# EAGLE schematic +5V_-5V_3.3V_PowerSupply (EAGLE 7.2.0)
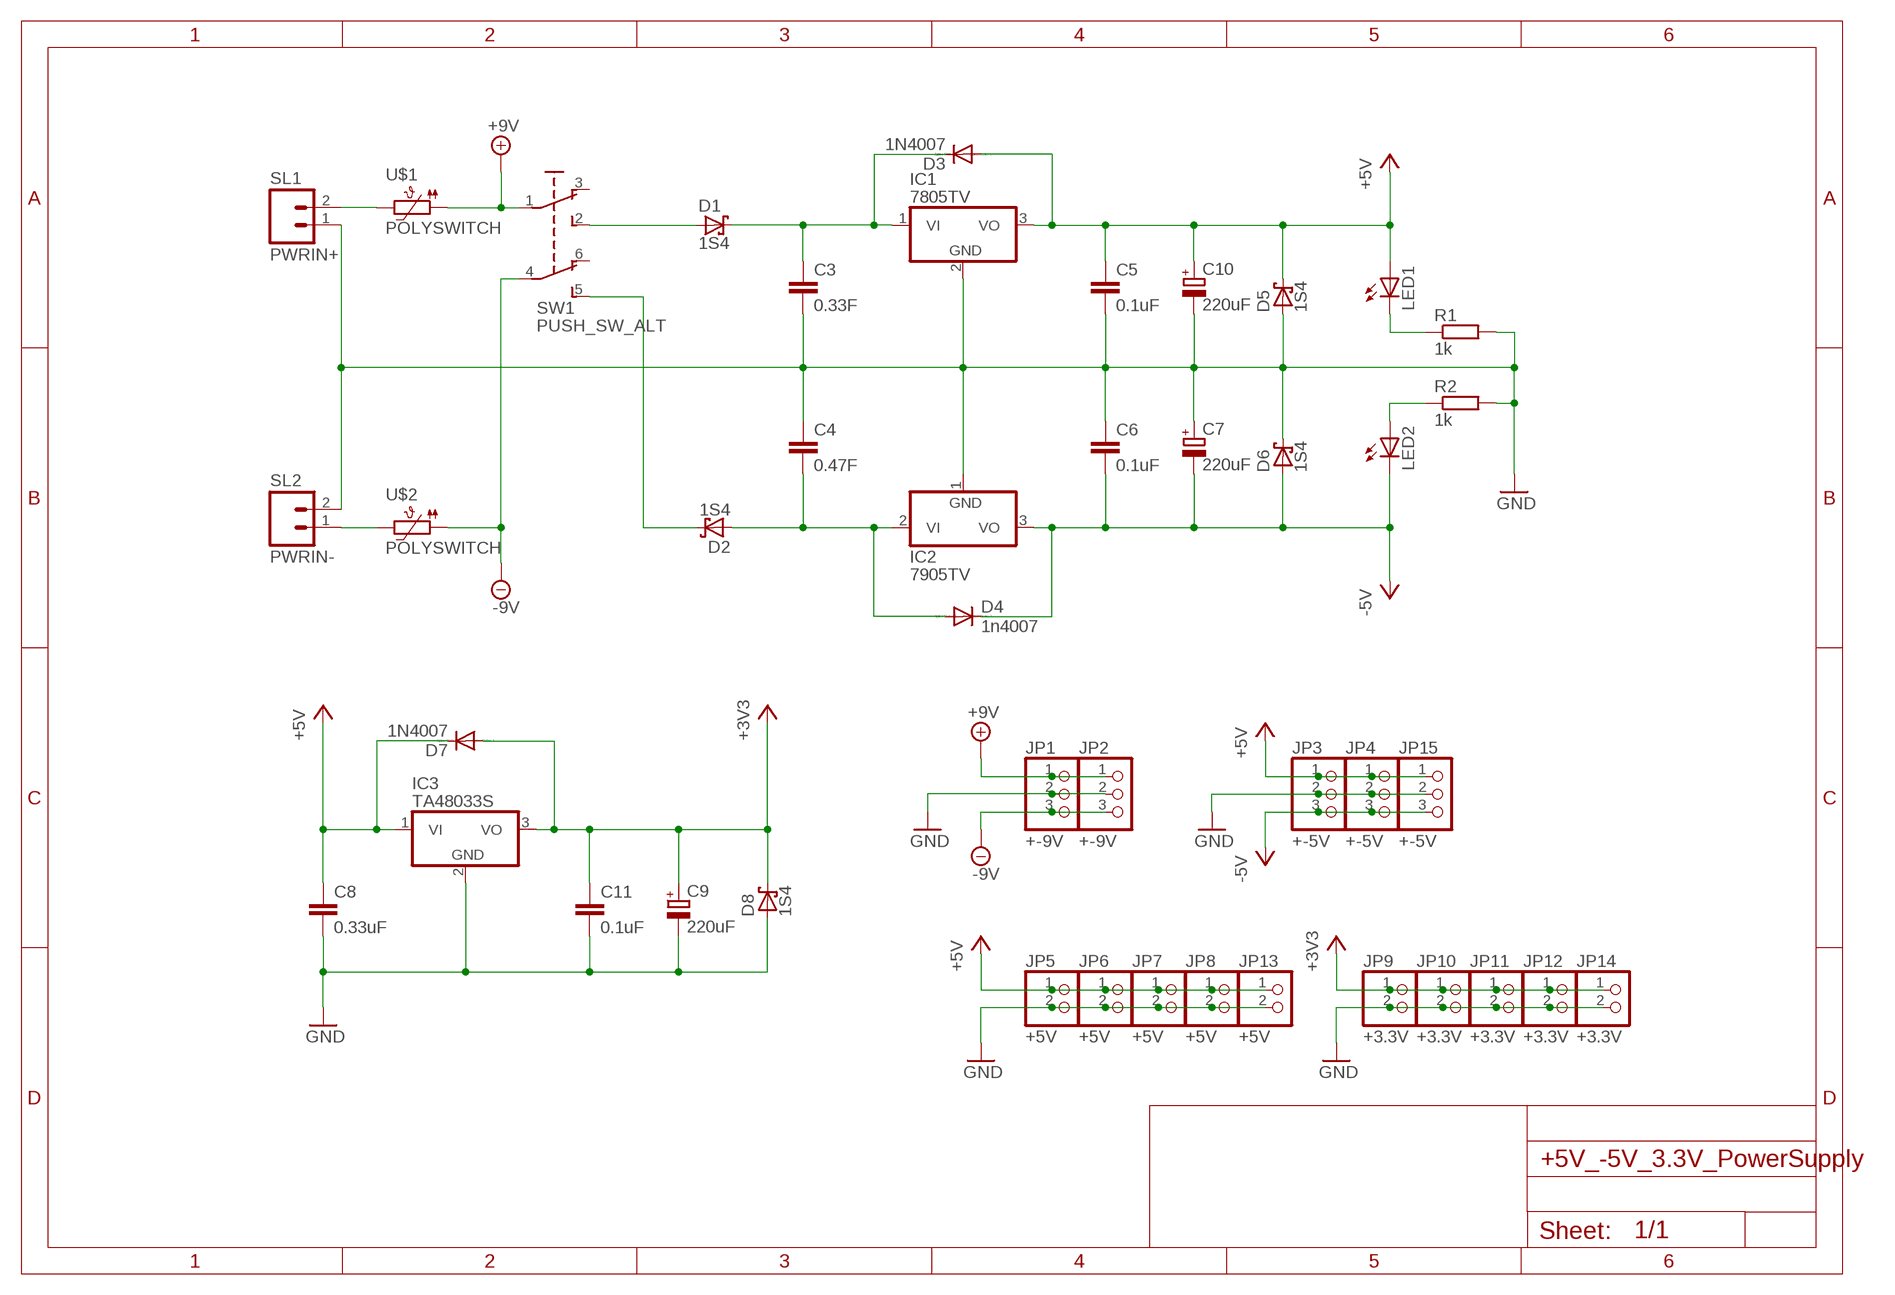
[diagram p0: schematic, sheet 1]

## Parts
C3  0.33F  C-EU050-025X075  [C050-025X075]
C4  0.47F  C-EU050-025X075  [C050-025X075]
C5  0.1uF  C-EU050-024X044  [C050-024X044]
C6  0.1uF  C-EU050-024X044  [C050-024X044]
C7  220uF  CPOL-EUE2.5-6  [E2,5-6]
C8  0.33uF  C-EU050-025X075  [C050-025X075]
C9  220uF  CPOL-EUE2.5-6  [E2,5-6]
C10  220uF  CPOL-EUE2.5-6  [E2,5-6]
C11  0.1uF  C-EU050-025X075  [C050-025X075]
D1  1S4  SCHOTTKY-DIODEDO35-7  [DO35-7]
D2  1S4  SCHOTTKY-DIODEDO35-7  [DO35-7]
D3  1N4007  DIODE-D-7.5  [D-7.5]
D4  1n4007  DIODE-D-7.5  [D-7.5]
D5  1S4  SCHOTTKY-DIODEDO35-7  [DO35-7]
D6  1S4  SCHOTTKY-DIODEDO35-7  [DO35-7]
D7  1N4007  DIODE-D-7.5  [D-7.5]
D8  1S4  SCHOTTKY-DIODEDO35-7  [DO35-7]
IC1  7805TV  [TO220V]
IC2  7905TV  [TO220V]
IC3  TA48033S  7805TV  [TO220V]
JP1  +-9V  PINHD-1X3  [1X03]
JP2  +-9V  PINHD-1X3  [1X03]
JP3  +-5V  PINHD-1X3  [1X03]
JP4  +-5V  PINHD-1X3  [1X03]
JP5  +5V  PINHD-1X2  [1X02]
JP6  +5V  PINHD-1X2  [1X02]
JP7  +5V  PINHD-1X2  [1X02]
JP8  +5V  PINHD-1X2  [1X02]
JP9  +3.3V  PINHD-1X2  [1X02]
JP10  +3.3V  PINHD-1X2  [1X02]
JP11  +3.3V  PINHD-1X2  [1X02]
JP12  +3.3V  PINHD-1X2  [1X02]
JP13  +5V  PINHD-1X2  [1X02]
JP14  +3.3V  PINHD-1X2  [1X02]
JP15  +-5V  PINHD-1X3  [1X03]
LED1  LED3MM  [LED3MM]
LED2  LED3MM  [LED3MM]
R1  1k  R-EU_0207/7  [0207/7]
R2  1k  R-EU_0207/7  [0207/7]
SL1  PWRIN+  M02  [02P]
SL2  PWRIN-  M02  [02P]
SW1  PUSH_SW_ALT  [PUSH_SW_ALT]
U$1  POLYSWITCH  [POLYSWITCH]
U$2  POLYSWITCH  [POLYSWITCH]

## Nets
+3V3: C9.+ C11.1 D7.A D8.C IC3.3(VO) JP9.1 JP10.1 JP11.1 JP12.1 JP14.1
+5V: C5.1 C8.1 C10.+ D3.A D5.C D7.C IC1.3(VO) IC3.1(VI) JP3.1 JP4.1 JP5.1 JP6.1 JP7.1 JP8.1 JP13.1 JP15.1 LED1.A
+9V: JP1.1 JP2.1 SW1.1(P) U$1.1
-5V: C6.2 C7.- D4.C D6.A IC2.3(VO) JP3.3 JP4.3 JP15.3 LED2.K(C)
-9V: JP1.3 JP2.3 SW1.4(P1) U$2.1
GND: C3.2 C4.1 C5.2 C6.1 C7.+ C8.2 C9.- C10.- C11.2 D5.A D6.C D8.A IC1.2(GND) IC2.1(GND) IC3.2(GND) JP1.2 JP2.2 JP3.2 JP4.2 JP5.2 JP6.2 JP7.2 JP8.2 JP9.2 JP10.2 JP11.2 JP12.2 JP13.2 JP14.2 JP15.2 R1.2 R2.2 SL1.1 SL2.2
N$1: SL2.1 U$2.2
N$3: D1.A SW1.2(S)
N$4: D2.C SW1.5(S1)
N$5: C3.1 D1.C D3.C IC1.1(VI)
N$6: LED1.K(C) R1.1
N$7: C4.2 D2.A D4.A IC2.2(VI)
N$8: LED2.A R2.1
N$10: SL1.2 U$1.2
Unconnected: SW1.3(O) SW1.6(O1)

## Library data of the parts
C3-C6 C8 C11 = rcl:C-EU: CAPACITOR, European symbol
C7 C9 C10 = rcl:CPOL-EU: POLARIZED CAPACITOR, European symbol
D1 D2 D5 D6 D8 = diode:SCHOTTKY-DIODE: Schottky Diode
D3 D4 D7 = diode:DIODE-: DIODE
IC1 IC3 = linear:78*: Positive VOLTAGE REGULATOR Source: http://cache.national.com/ds/LM/LM78L05.pdf http://www.fairchildsemi.com/ds/LM/LM7805.pdf
IC2 = mylib2:7905TV
JP1-JP4 JP15 = pinhead:PINHD-1X3: PIN HEADER
JP5-JP14 = pinhead:PINHD-1X2: PIN HEADER
LED1 LED2 = led:LED: LED OSRAM: - CHIPLED LG R971, LG N971, LY N971, LG Q971, LY Q971, LO R971, LY R971 LH N974, LH R974 LS Q976, LO Q976, LY Q976 LO Q996 - Hyper CHIPLED LW Q18S LB Q993, LB Q99A, LB R99A - SideLED LS A670, LO A670, LY A670, LG A670, LP A670 LB A673, LV A673, LT A673, LW A673 LH A674 LY A675 LS A676, LA A676, LO A676, LY A676, LW A676 LS A679, LY A679, LG A679 - Hyper Micro SIDELED® LS Y876, LA Y876, LO Y876, LY Y876 LT Y87S - SmartLED LW L88C, LW L88S LB L89C, LB L89S, LG L890 LS L89K, LO L89K, LY L89K LS L896, LA L896, LO L896, LY L896 - TOPLED LS T670, LO T670, LY T670, LG T670, LP T670 LSG T670, LSP T670, LSY T670, LOP T670, LYG T670 LG T671, LOG T671, LSG T671 LB T673, LV T673, LT T673, LW T673 LH T674 LS T676, LA T676, LO T676, LY T676, LB T676, LH T676, LSB T676, LW T676 LB T67C, LV T67C, LT T67C, LS T67K, LO T67K, LY T67K, LW E67C LS E67B, LA E67B, LO E67B, LY E67B, LB E67C, LV E67C, LT E67C LW T67C LS T679, LY T679, LG T679 LS T770, LO T770, LY T770, LG T770, LP T770 LB T773, LV T773, LT T773, LW T773 LH T774 LS E675, LA E675, LY E675, LS T675 LS T776, LA T776, LO T776, LY T776, LB T776 LHGB T686 LT T68C, LB T68C - Hyper Mini TOPLED® LB M676 - Mini TOPLED Santana® LG M470 LS M47K, LO M47K, LY M47K Source: http://www.osram.convergy.de LUXEON: - LUMILED® LXK2-PW12-R00, LXK2-PW12-S00, LXK2-PW14-U00, LXK2-PW14-V00 LXK2-PM12-R00, LXK2-PM12-S00, LXK2-PM14-U00 LXK2-PE12-Q00, LXK2-PE12-R00, LXK2-PE12-S00, LXK2-PE14-T00, LXK2-PE14-U00 LXK2-PB12-K00, LXK2-PB12-L00, LXK2-PB12-M00, LXK2-PB14-N00, LXK2-PB14-P00, LXK2-PB14-Q00 LXK2-PR12-L00, LXK2-PR12-M00, LXK2-PR14-Q00, LXK2-PR14-R00 LXK2-PD12-Q00, LXK2-PD12-R00, LXK2-PD12-S00 LXK2-PH12-R00, LXK2-PH12-S00 LXK2-PL12-P00, LXK2-PL12-Q00, LXK2-PL12-R00 Source: www.luxeon.com KINGBRIGHT: KA-3528ASYC Source: www.kingbright.com
R1 R2 = rcl:R-EU_: RESISTOR, European symbol
SL1 SL2 = con-amp-quick:M02: AMP QUICK CONNECTOR; OC_FARNELL: unknown; OC_NEWARK: unknown
SW1 = mylib2:PUSH_SW_ALT
U$1 U$2 = mylib2:POLYSWITCH